# Altium schematic sheet TPS799.SchDoc
size A4
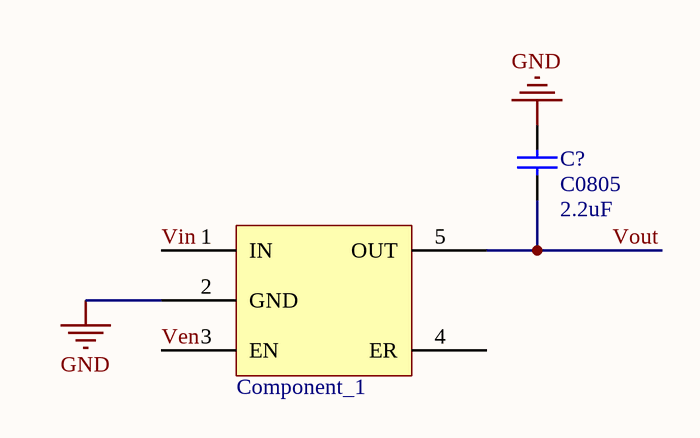
[diagram p0: TPS799.SchDoc]

## Parts
?  Component_1  [SOP5]
C?  C0805  value 2.2uF  [0805]

## Nets
GND: ?.2(GND) C?.2
Ven: ?.3(EN)
Vin: ?.1(IN)
Vout: ?.5(OUT) C?.1

Not connected (* = marked no-connect by the designer): ? 4(ER)

## Library data of the parts
C? = C0805: Ceramic Chip Capacitor - Standard; Note: Footprint corresponds to dimensions for bulk cassette packaging. This case size has tightened tolerances.; Published: 17-Jul-2002; LatestRevisionDate: 19-Mar-2004; LatestRevisionNote: Silkscreen size reduced.; DatasheetDocument: Mar-2001; PackageDocument: Mar-2001; PackageReference: 0805; Publisher: Altium Limited; Code_JEITA: 0805; Code_IPC: 2012[0805]; ComponentLink1Description: Manufacturer Link; ComponentLink1URL: http://www.kemet.com/; ComponentLink2Description: Datasheet; ComponentLink2URL: http://www.kemet.com/kemet/web/homepage/kechome.nsf/vapubfilesname/F3102TA.pdf/$file/F3102TA.pdf